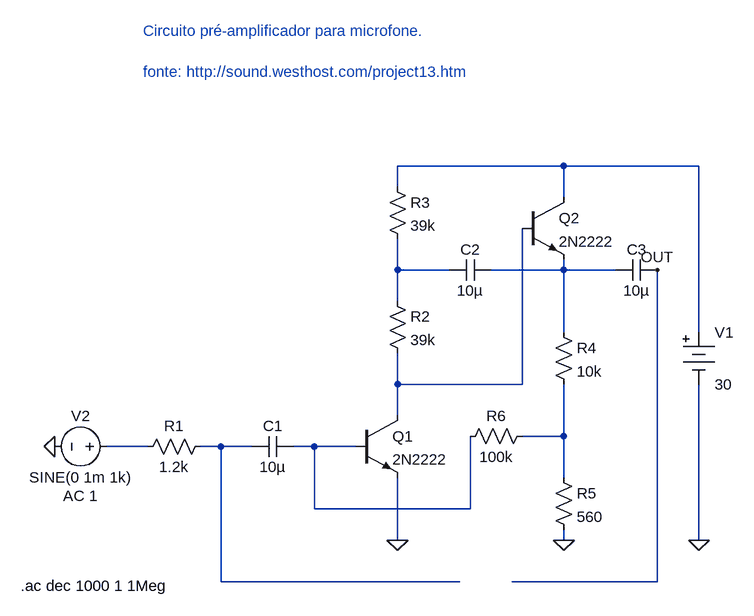
[diagram p0: schematic ex3_mic_preamp.asc]
ex3_mic_preamp.asc, the LTspice schematic file:
Version 4
SHEET 1 904 680
WIRE 464 -320 208 -320
WIRE 672 -320 464 -320
WIRE 208 -288 208 -320
WIRE 464 -272 464 -320
WIRE 208 -160 208 -208
WIRE 288 -160 208 -160
WIRE 464 -160 464 -176
WIRE 464 -160 352 -160
WIRE 544 -160 464 -160
WIRE 208 -112 208 -160
WIRE 464 -64 464 -160
WIRE 672 -64 672 -320
WIRE 208 16 208 -32
WIRE 400 16 400 -224
WIRE 400 16 208 16
WIRE 208 64 208 16
WIRE 464 96 464 16
WIRE 464 96 400 96
WIRE -176 112 -240 112
WIRE -64 112 -96 112
WIRE -16 112 -64 112
WIRE 80 112 48 112
WIRE 144 112 80 112
WIRE 464 160 464 96
WIRE 80 208 80 112
WIRE 320 208 320 96
WIRE 320 208 80 208
WIRE 208 256 208 160
WIRE 464 256 464 240
WIRE 672 256 672 16
WIRE -64 320 -64 112
WIRE 304 320 -64 320
WIRE 608 320 608 -160
WIRE 608 320 384 320
FLAG 208 256 0
FLAG 608 -160 OUT
FLAG 464 256 0
FLAG 672 256 0
FLAG -320 112 0
SYMBOL res -80 96 R90
WINDOW 0 0 56 VBottom 2
WINDOW 3 32 56 VTop 2
SYMATTR InstName R1
SYMATTR Value 1.2k
SYMBOL cap 48 96 R90
WINDOW 0 0 32 VBottom 2
WINDOW 3 32 32 VTop 2
SYMATTR InstName C1
SYMATTR Value 10µ
SYMBOL npn 144 64 R0
SYMATTR InstName Q1
SYMATTR Value 2N2222
SYMBOL res 192 -128 R0
SYMATTR InstName R2
SYMATTR Value 39k
SYMBOL res 192 -304 R0
SYMATTR InstName R3
SYMATTR Value 39k
SYMBOL Misc\\battery 672 -80 R0
SYMATTR InstName V1
SYMATTR Value 30
SYMBOL cap 352 -176 R90
WINDOW 0 0 32 VBottom 2
WINDOW 3 32 32 VTop 2
SYMATTR InstName C2
SYMATTR Value 10µ
SYMBOL npn 400 -272 R0
SYMATTR InstName Q2
SYMATTR Value 2N2222
SYMBOL cap 608 -176 R90
WINDOW 0 0 32 VBottom 2
WINDOW 3 32 32 VTop 2
SYMATTR InstName C3
SYMATTR Value 10µ
SYMBOL res 448 -80 R0
SYMATTR InstName R4
SYMATTR Value 10k
SYMBOL res 448 144 R0
SYMATTR InstName R5
SYMATTR Value 560
SYMBOL res 416 80 R90
WINDOW 0 0 56 VBottom 2
WINDOW 3 32 56 VTop 2
SYMATTR InstName R6
SYMATTR Value 100k
SYMBOL voltage -224 112 R90
WINDOW 0 -32 56 VBottom 2
WINDOW 3 32 56 VTop 2
WINDOW 123 60 56 VTop 2
WINDOW 39 0 0 Left 2
SYMATTR InstName V2
SYMATTR Value SINE(0 1m 1k)
SYMATTR Value2 AC 1
TEXT -184 -528 Left 2 ;Circuito pré-amplificador para microfone.\n \nfonte: http://sound.westhost.com/project13.htm
TEXT -372 326 Left 2 !.ac dec 1000 1 1Meg

The netlist it stands for:
* ex3_mic_preamp.asc
R1 N007 N006 1.2k
C1 N008 N007 10µ
Q1 N004 N008 0 0 2N2222
R2 N002 N004 39k
R3 N001 N002 39k
V1 N001 0 30
C2 N003 N002 10µ
Q2 N001 N004 N003 0 2N2222
C3 OUT N003 10µ
R4 N003 N005 10k
R5 N005 0 560
R6 N005 N008 100k
V2 N006 0 SINE(0 1m 1k) AC 1
.model NPN NPN
.model PNP PNP
.lib standard.bjt
* Circuito pré-amplificador para microfone.
* fonte: http://sound.westhost.com/project13.htm
.ac dec 1000 1 1Meg
.backanno
.end